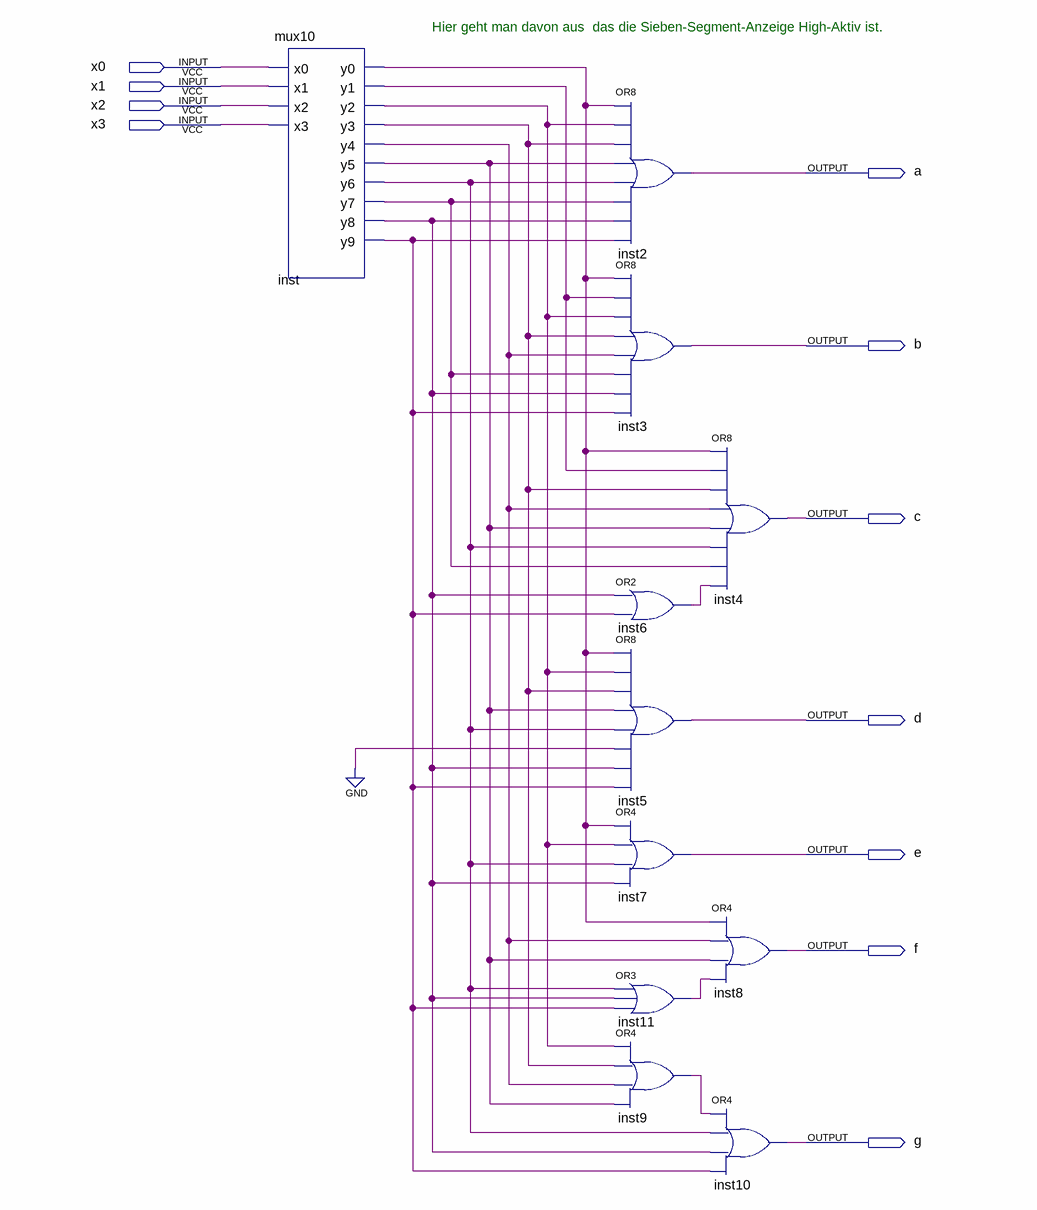
[diagram p0: schematic sheet]
// Quartus schematic hex2seg_sch.bdf as structural Verilog: 11 symbols, 11 pins
module hex2seg_sch (
  input  x0,
  input  x1,
  input  x2,
  input  x3,
  output a,
  output b,
  output c,
  output d,
  output e,
  output f,
  output g
);

  wire inst6_out, inst9_out, inst11_out, inst_y0, inst_y1, inst_y2, inst_y3, inst_y4, inst_y5, inst_y6,
       inst_y7, inst_y8, inst_y9;

  mux10 inst (
    .x0(x0), .x1(x1), .x2(x2), .x3(x3), .y0(inst_y0), .y1(inst_y1), .y2(inst_y2), .y3(inst_y3), .y4(inst_y4),
    .y5(inst_y5), .y6(inst_y6), .y7(inst_y7), .y8(inst_y8), .y9(inst_y9));
  or inst2 (a, inst_y0, inst_y2, inst_y3, inst_y5, inst_y6, inst_y7, inst_y8, inst_y9);
  or inst3 (b, inst_y0, inst_y1, inst_y2, inst_y3, inst_y4, inst_y7, inst_y8, inst_y9);
  or inst6 (inst6_out, inst_y8, inst_y9);
  or inst5 (d, inst_y0, inst_y2, inst_y3, inst_y5, inst_y6, 1'b0, inst_y8, inst_y9);
  or inst7 (e, inst_y0, inst_y2, inst_y6, inst_y8);
  or inst11 (inst11_out, inst_y6, inst_y8, inst_y9);
  or inst9 (inst9_out, inst_y2, inst_y3, inst_y4, inst_y5);
  or inst4 (c, inst_y0, inst_y1, inst_y3, inst_y4, inst_y5, inst_y6, inst_y7, inst6_out);
  or inst8 (f, inst_y0, inst_y4, inst_y5, inst11_out);
  or inst10 (g, inst9_out, inst_y6, inst_y8, inst_y9);

  // Notes on the sheet:
  //   Hier geht man davon aus  das die Sieben-Segment-Anzeige High-Aktiv ist.
endmodule
